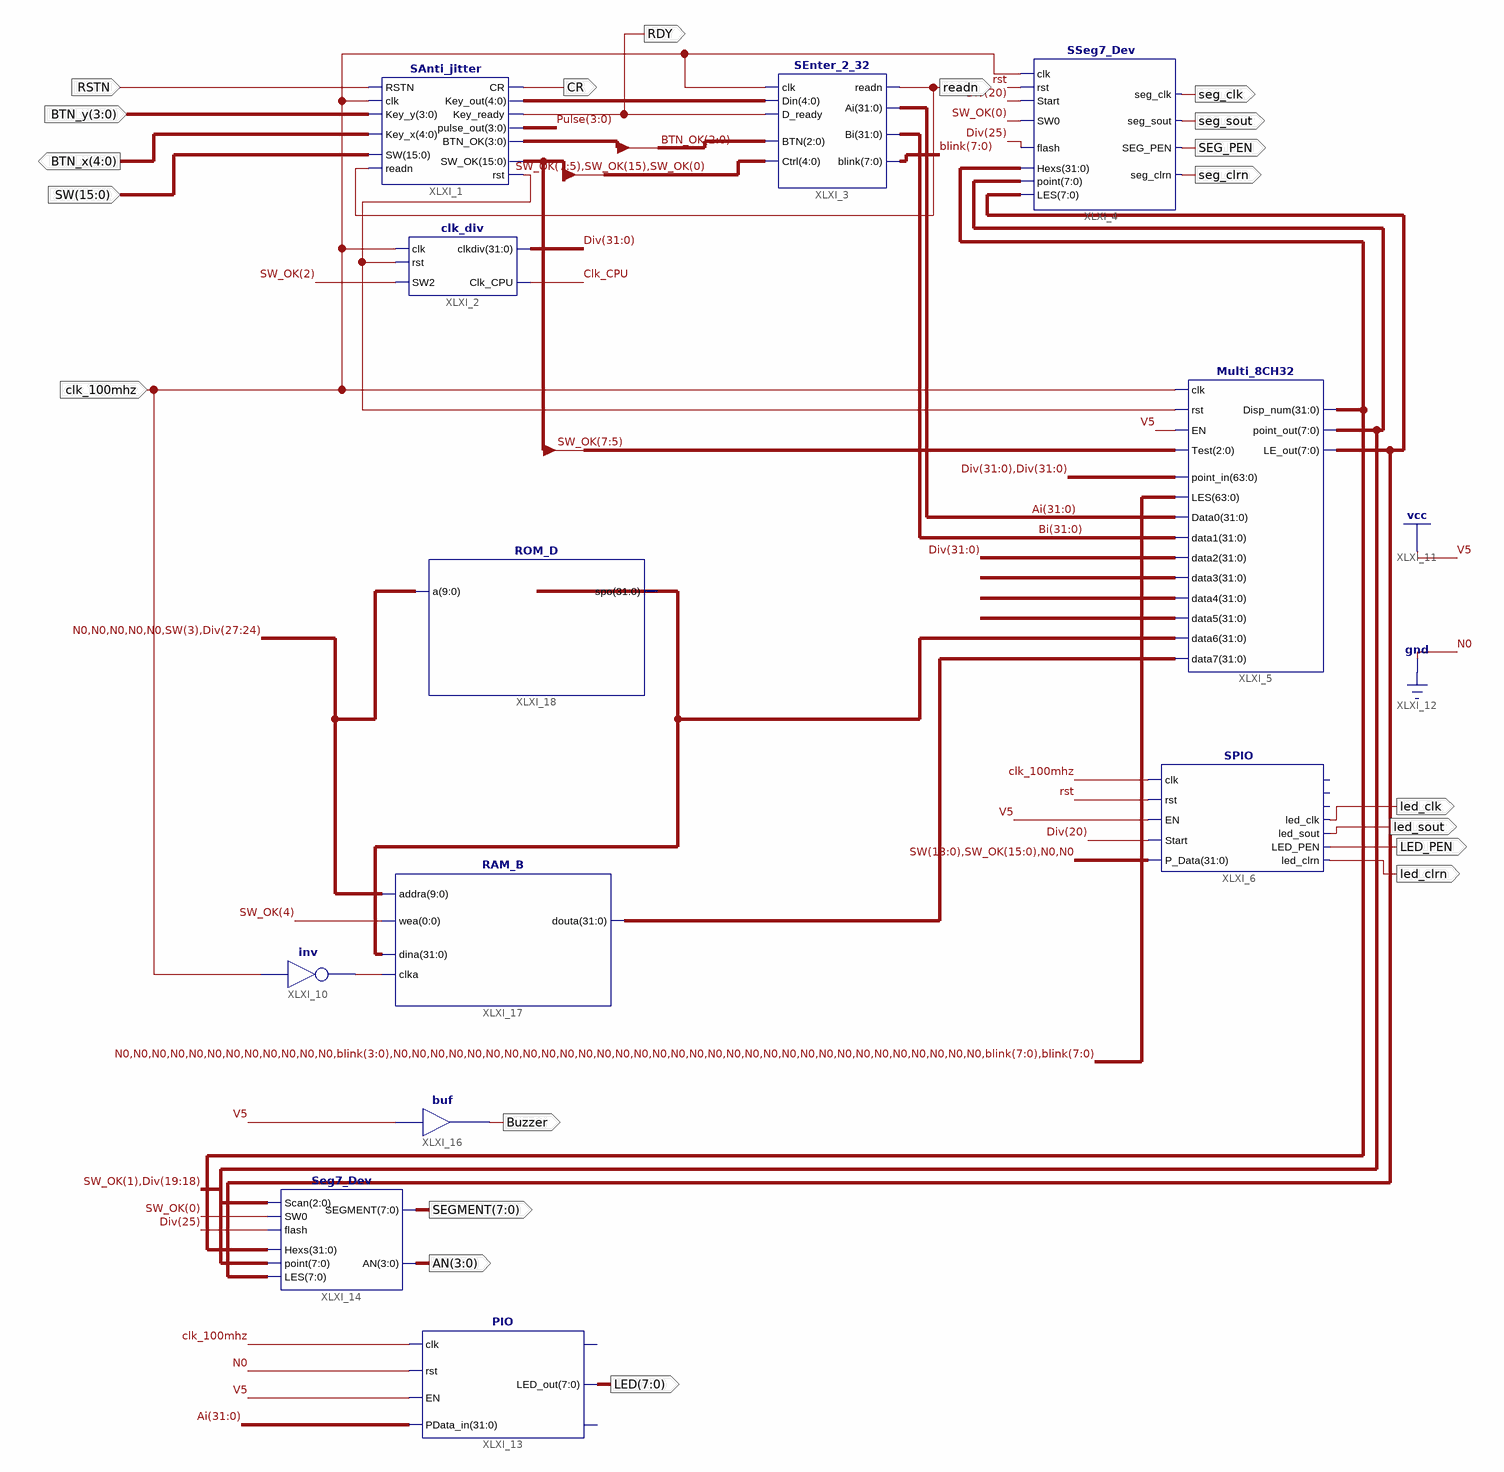
[diagram p0: schematic sheet 1]
// Xilinx ISE schematic OrgLab1.sch (kintex7) as structural Verilog: 12 symbols, 20 ports
module OrgLab1 (
  input  RSTN,
  input  [3:0] BTN_y,
  input  [15:0] SW,
  input  clk_100mhz,
  output [4:0] BTN_x,
  output CR,
  output RDY,
  output readn,
  output seg_clk,
  output seg_sout,
  output SEG_PEN,
  output seg_clrn,
  output led_clk,
  output led_sout,
  output LED_PEN,
  output led_clrn,
  output [7:0] SEGMENT,
  output [3:0] AN,
  output Buzzer,
  output [7:0] LED
);

  wire Clk_CPU, rst, XLXN_34, XLXN_55;
  wire [3:0] BTN_OK, Pulse;
  wire [4:0] XLXN_13;
  wire [7:0] blink, LE_out, point_out;
  wire [15:0] SW_OK;
  wire [31:0] Ai, Bi, Disp_num, Div, XLXN_58, XLXN_60, XLXN_63, XLXN_64, XLXN_65;

  SAnti_jitter XLXI_1 (
    .SW(SW), .readn(readn), .Key_y(BTN_y), .Key_x(BTN_x), .RSTN(RSTN), .clk(clk_100mhz), .Key_out(XLXN_13),
    .Key_ready(RDY), .CR(CR), .rst(XLXN_34), .SW_OK(SW_OK), .pulse_out(Pulse), .BTN_OK(BTN_OK));
  clk_div XLXI_2 (.rst(XLXN_34), .clk(clk_100mhz), .SW2(SW_OK[2]), .clkdiv(Div), .Clk_CPU(Clk_CPU));
  SEnter_2_32 XLXI_3 (
    .readn(readn), .Ai(Ai), .Bi(Bi), .blink(blink), .Din(XLXN_13), .D_ready(RDY), .clk(clk_100mhz),
    .Ctrl({SW_OK[7:5], SW_OK[15], SW_OK[0]}), .BTN(BTN_OK[2:0]));
  SSeg7_Dev XLXI_4 (
    .LES(LE_out), .SEG_PEN(SEG_PEN), .seg_sout(seg_sout), .seg_clrn(seg_clrn), .point(point_out),
    .Hexs(Disp_num), .SW0(SW_OK[0]), .flash(Div[25]), .seg_clk(seg_clk), .clk(clk_100mhz), .rst(rst),
    .Start(Div[20]));
  Multi_8CH32 XLXI_5 (
    .Test(SW_OK[7:5]), .point_in({Div, Div}), .EN(1'b1), .clk(clk_100mhz), .rst(XLXN_34),
    .LES({{12{1'b0}}, blink[3:0], {32{1'b0}}, blink, blink}), .Data0(Ai), .data1(Bi), .data2(Div),
    .data3(XLXN_63), .data4(XLXN_64), .data5(XLXN_65), .data6(XLXN_58), .data7(XLXN_60),
    .point_out(point_out), .LE_out(LE_out), .Disp_num(Disp_num));
  SPIO XLXI_6 (
    .clk(clk_100mhz), .P_Data({SW[13:0], SW_OK, 2'b00}), .rst(rst), .EN(1'b1), .Start(Div[20]),
    .led_clk(led_clk), .led_clrn(led_clrn), .LED_PEN(LED_PEN), .led_sout(led_sout));  // open: GPIOf0, LED_out, counter_set
  not XLXI_10 (XLXN_55, clk_100mhz);
  PIO XLXI_13 (.clk(clk_100mhz), .rst(1'b0), .EN(1'b1), .PData_in(Ai), .LED_out(LED));  // open: GPIOf0, counter_set
  Seg7_Dev XLXI_14 (
    .LES(LE_out), .Scan({SW_OK[1], Div[19:18]}), .SEGMENT(SEGMENT), .AN(AN), .point(point_out),
    .flash(Div[25]), .SW0(SW_OK[0]), .Hexs(Disp_num));
  buf XLXI_16 (Buzzer, 1'b1);
  RAM_B XLXI_17 (
    .addra({{5{1'b0}}, SW[3], Div[27:24]}), .clka(XLXN_55), .wea(SW_OK[4]), .dina(XLXN_58), .douta(XLXN_60));
  ROM_D XLXI_18 (.a({{5{1'b0}}, SW[3], Div[27:24]}), .spo(XLXN_58));
endmodule
